# EAGLE design EL-100-020-020-PT1000 (EAGLE 6.6.0)

## Sheet 1 of 2
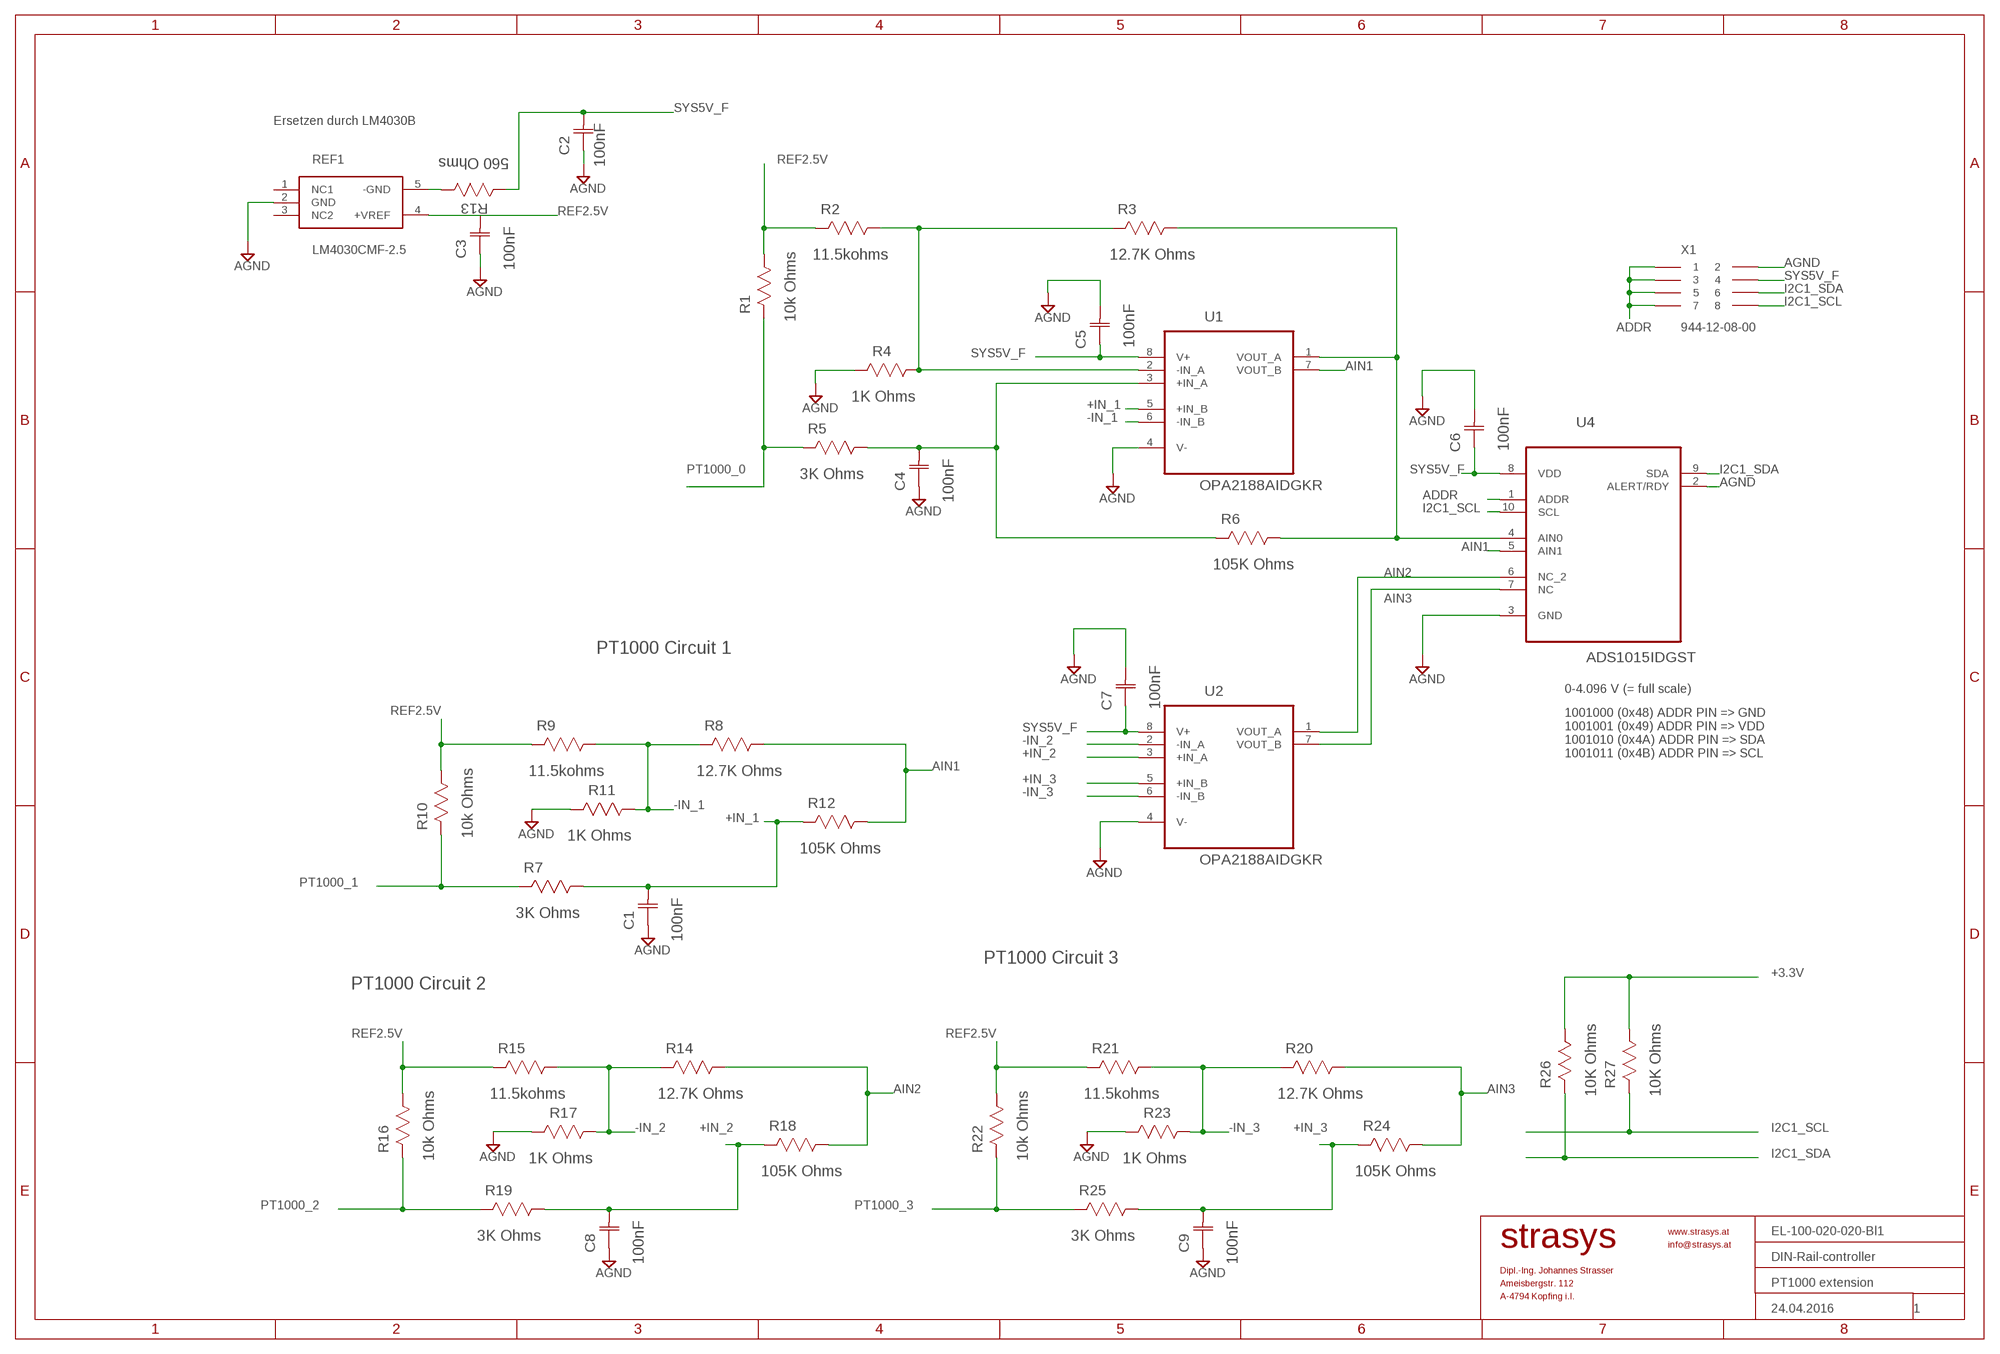
[diagram p0: schematic, sheet 1]
FRAME1 (A3L-LOC): DATE_DRAWING: 24.04.2016; DRAWING_NAME1: DIN-Rail-controller; DRAWING_NAME2: PT1000 extension; DRAWING_NO: EL-100-020-020-Bl1; PAGE: 1

### Parts
C1  100nF  C0805C104K5RACTU  [CAPC2013X110N]
C2  100nF  C0805C104K5RACTU  [CAPC2013X110N]
C3  100nF  C0805C104K5RACTU  [CAPC2013X110N]
C4  100nF  C0805C104K5RACTU  [CAPC2013X110N]
C5  100nF  C0805C104K5RACTU  [CAPC2013X110N]
C6  100nF  C0805C104K5RACTU  [CAPC2013X110N]
C7  100nF  C0805C104K5RACTU  [CAPC2013X110N]
C8  100nF  C0805C104K5RACTU  [CAPC2013X110N]
C9  100nF  C0805C104K5RACTU  [CAPC2013X110N]
R1  10k Ohms  CRCW080524K9FKEA  [RESC2013X65N]
R2  11.5kohms  ERJ6ENF3242V  [RESC2013X65N]
R3  12.7K Ohms  CRCW080530K0FKEA  [RESC2013X65N]
R4  1K Ohms  CRCW08051K00FKEA  [RESC2013X65N]
R5  3K Ohms  CRCW080530K0FKEA  [RESC2013X65N]
R6  105K Ohms  CRCW0805105KFKEA  [RESC2013X65N]
R7  3K Ohms  CRCW080530K0FKEA  [RESC2013X65N]
R8  12.7K Ohms  CRCW080530K0FKEA  [RESC2013X65N]
R9  11.5kohms  ERJ6ENF3242V  [RESC2013X65N]
R10  10k Ohms  CRCW080524K9FKEA  [RESC2013X65N]
R11  1K Ohms  CRCW08051K00FKEA  [RESC2013X65N]
R12  105K Ohms  CRCW0805105KFKEA  [RESC2013X65N]
R13  560 Ohms  CRCW080510K0JNEA  [RESC2013X65N]
R14  12.7K Ohms  CRCW080530K0FKEA  [RESC2013X65N]
R15  11.5kohms  ERJ6ENF3242V  [RESC2013X65N]
R16  10k Ohms  CRCW080524K9FKEA  [RESC2013X65N]
R17  1K Ohms  CRCW08051K00FKEA  [RESC2013X65N]
R18  105K Ohms  CRCW0805105KFKEA  [RESC2013X65N]
R19  3K Ohms  CRCW080530K0FKEA  [RESC2013X65N]
R20  12.7K Ohms  CRCW080530K0FKEA  [RESC2013X65N]
R21  11.5kohms  ERJ6ENF3242V  [RESC2013X65N]
R22  10k Ohms  CRCW080524K9FKEA  [RESC2013X65N]
R23  1K Ohms  CRCW08051K00FKEA  [RESC2013X65N]
R24  105K Ohms  CRCW0805105KFKEA  [RESC2013X65N]
R25  3K Ohms  CRCW080530K0FKEA  [RESC2013X65N]
R26  10K Ohms  CRCW080510K0JNEA  [RESC2013X65N]
R27  10K Ohms  CRCW080510K0JNEA  [RESC2013X65N]
REF1  LM4030CMF-2.5  [R-PDSO-G5]
U1  OPA2188AIDGKR  [SOP65P490X110-8N]
U2  OPA2188AIDGKR  [SOP65P490X110-8N]
U4  ADS1015IDGST  [SOP50P490X110-10N]
X1  944-12-08-00  [2,54_2X8]

### Nets
+3.3V: R26.1 R27.1 ; also sheet 2
+IN_0: C4.2(C2) R5.1 R6.2 U1.3(+IN_A)
+IN_1: C1.2(C2) R7.1 R12.2 U1.5(+IN_B)
+IN_2: C8.2(C2) R18.2 R19.1 U2.3(+IN_A)
+IN_3: C9.2(C2) R24.2 R25.1 U2.5(+IN_B)
-IN_0: R2.1 R3.2 R4.1 U1.2(-IN_A)
-IN_1: R8.2 R9.1 R11.1 U1.6(-IN_B)
-IN_2: R14.2 R15.1 R17.1 U2.2(-IN_A)
-IN_3: R20.2 R21.1 R23.1 U2.6(-IN_B)
ADDR: U4.1(ADDR) X1.P1 X1.P3 X1.P5 X1.P7
AGND: C1.1(C1) C2.1(C1) C3.1(C1) C4.1(C1) C5.2(C2) C6.2(C2) C7.2(C2) C8.1(C1) C9.1(C1) R4.2 R11.2 R17.2 R23.2 REF1.2(GND) U1.4(V-) U2.4(V-) U4.2(ALERT/RDY) U4.3(GND) X1.P2 ; also sheet 2
AIN0: R3.1 R6.1 U1.1(VOUT_A) U4.4(AIN0)
AIN1: R8.1 R12.1 U1.7(VOUT_B) U4.5(AIN1)
AIN2: R14.1 R18.1 U2.1(VOUT_A) U4.6(NC_2)
AIN3: R20.1 R24.1 U2.7(VOUT_B) U4.7(NC)
I2C1_SCL: R27.2 U4.10(SCL) X1.P8 ; also sheet 2
I2C1_SDA: R26.2 U4.9(SDA) X1.P6 ; also sheet 2
N$1: R13.1 REF1.5(-GND)
PT1000_0: R1.2 R5.2 ; also sheet 2
PT1000_1: R7.2 R10.2 ; also sheet 2
PT1000_2: R16.2 R19.2 ; also sheet 2
PT1000_3: R22.2 R25.2 ; also sheet 2
REF2.5V: C3.2(C2) R1.1 R2.2 R9.2 R10.1 R15.2 R16.1 R21.2 R22.1 REF1.4(+VREF)
SYS5V_F: C2.2(C2) C5.1(C1) C6.1(C1) C7.1(C1) R13.2 U1.8(V+) U2.8(V+) U4.8(VDD) X1.P4 ; also sheet 2
Unconnected: REF1.1(NC1) REF1.3(NC2)

### Notes on the sheet
- Ersetzen durch LM4030B
- PT1000 Circuit 1
- 0-4.096 V (= full scale)
- 1001000 (0x48) ADDR PIN => GND
  1001001 (0x49) ADDR PIN => VDD
  1001010 (0x4A) ADDR PIN => SDA
  1001011 (0x4B) ADDR PIN => SCL
- PT1000 Circuit 3
- PT1000 Circuit 2

## Sheet 2 of 2
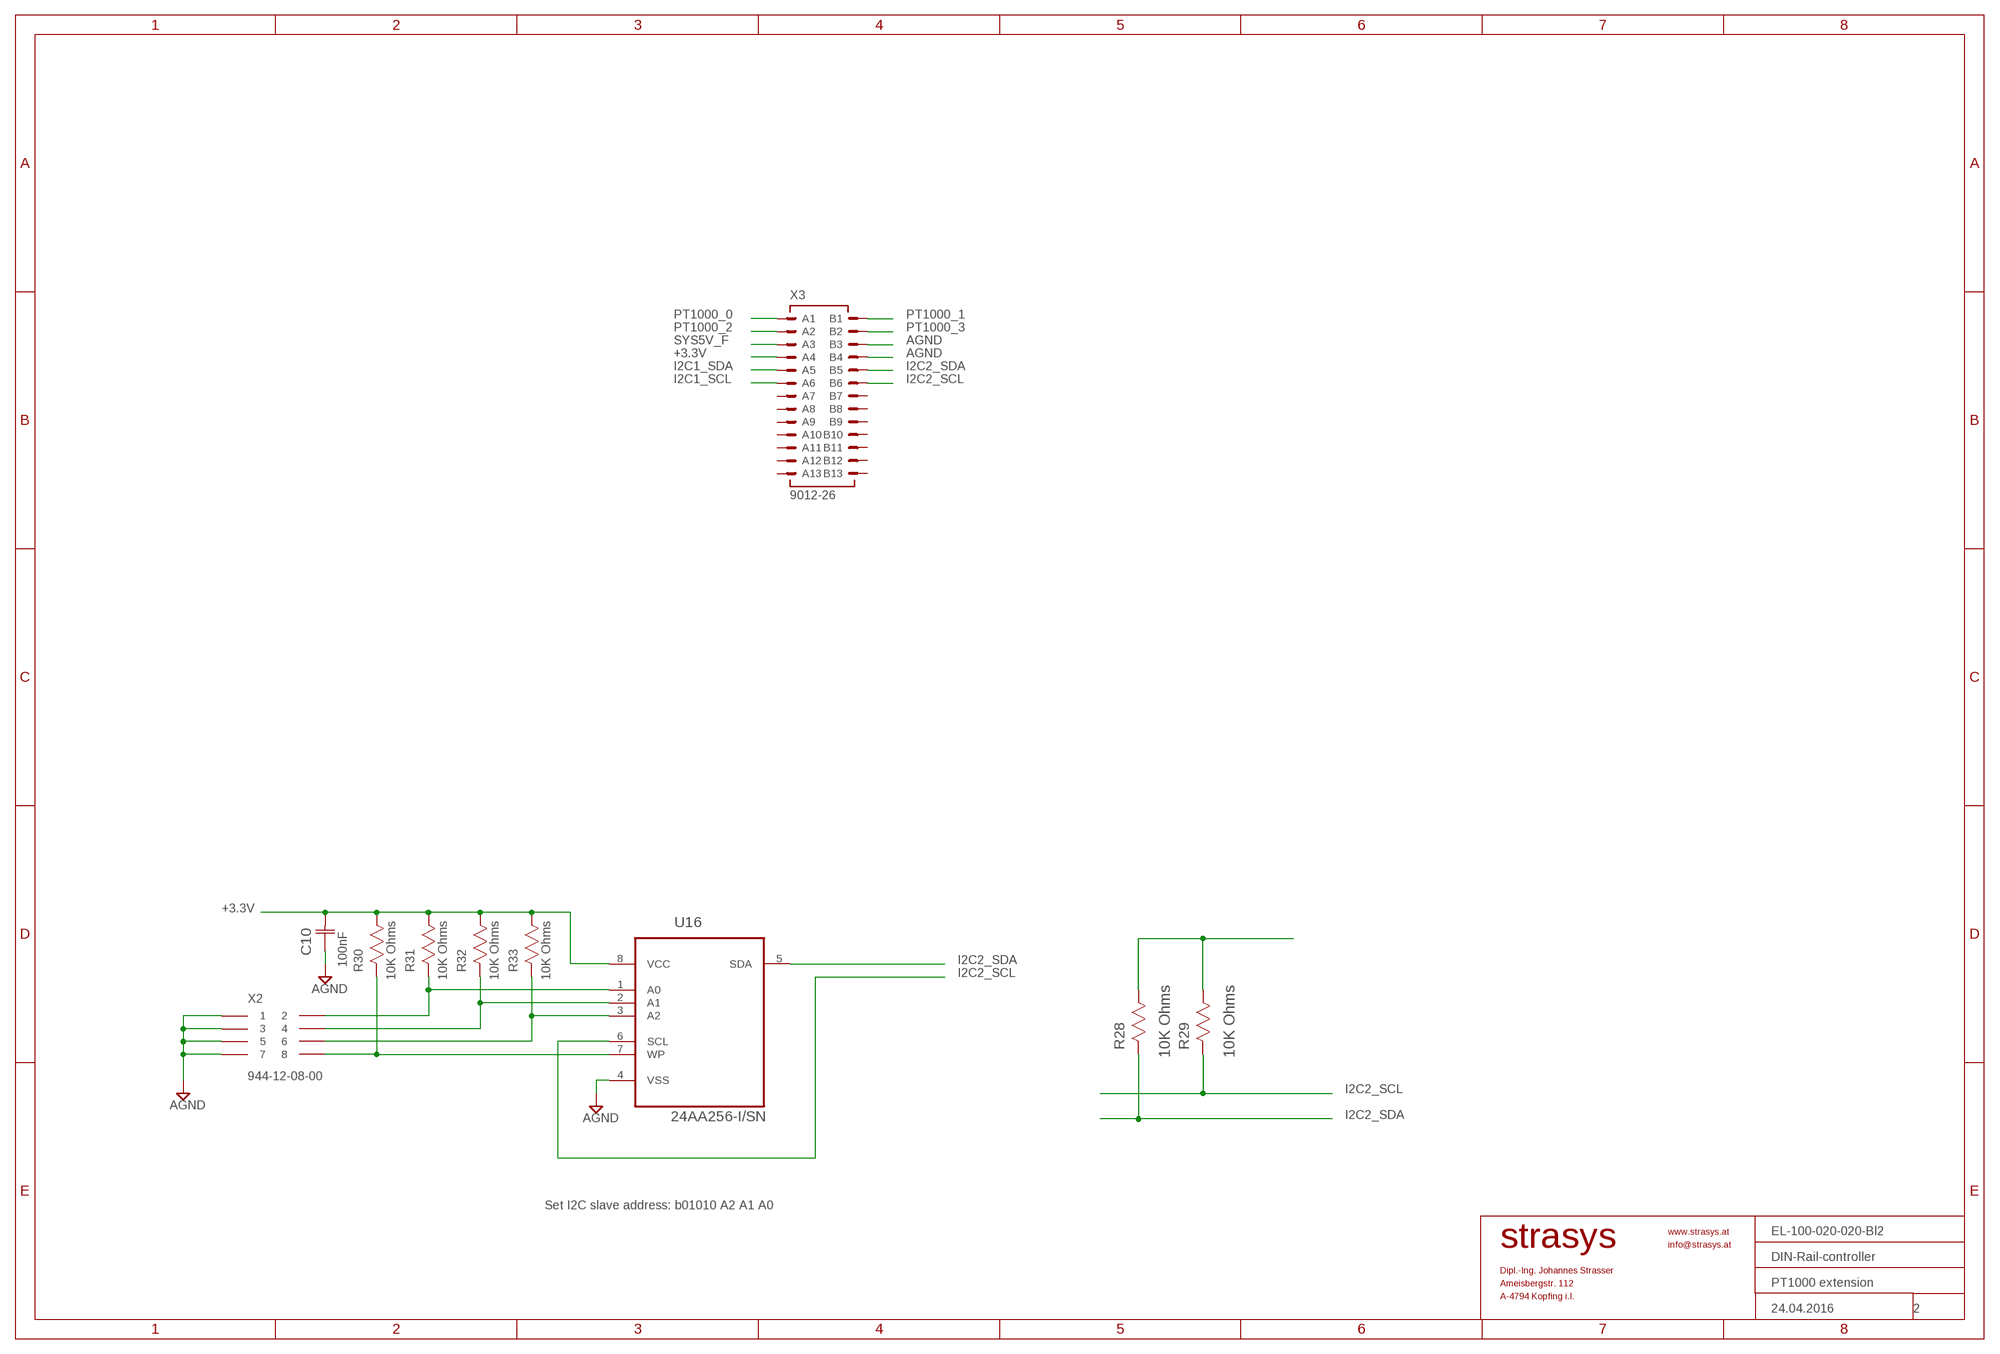
[diagram p1: schematic, sheet 2]
FRAME2 (A3L-LOC): DATE_DRAWING: 24.04.2016; DRAWING_NAME1: DIN-Rail-controller; DRAWING_NAME2: PT1000 extension; DRAWING_NO: EL-100-020-020-Bl2; PAGE: 2

### Parts
C10  100nF  C0805C104K5RACTU  [CAPC2013X110N]
R28  10K Ohms  CRCW080510K0JNEA  [RESC2013X65N]
R29  10K Ohms  CRCW080510K0JNEA  [RESC2013X65N]
R30  10K Ohms  CRCW080510K0JNEA  [RESC2013X65N]
R31  10K Ohms  CRCW080510K0JNEA  [RESC2013X65N]
R32  10K Ohms  CRCW080510K0JNEA  [RESC2013X65N]
R33  10K Ohms  CRCW080510K0JNEA  [RESC2013X65N]
U16  24AA256-I/SN  [SOIC127P600X175-8N]
X2  944-12-08-00  [2,54_2X8]
X3  9012-26  [9012-26]

### Nets
24AA-A0: R31.2 U16.1(A0) X2.P2
24AA_A1: R32.2 U16.2(A1) X2.P4
24AA_A2: R33.2 U16.3(A2) X2.P6
24AA_WP: R30.2 U16.7(WP) X2.P8
+3.3V: C10.2(C2) R28.1 R29.1 R30.1 R31.1 R32.1 R33.1 U16.8(VCC) X3.A4 ; also sheet 1
AGND: C10.1(C1) U16.4(VSS) X2.P1 X2.P3 X2.P5 X2.P7 X3.B3 X3.B4 ; also sheet 1
I2C1_SCL: X3.A6 ; also sheet 1
I2C1_SDA: X3.A5 ; also sheet 1
I2C2_SCL: R29.2 U16.6(SCL) X3.B6
I2C2_SDA: R28.2 U16.5(SDA) X3.B5
PT1000_0: X3.A1 ; also sheet 1
PT1000_1: X3.B1 ; also sheet 1
PT1000_2: X3.A2 ; also sheet 1
PT1000_3: X3.B2 ; also sheet 1
SYS5V_F: X3.A3 ; also sheet 1
Unconnected: X3.A7 X3.A8 X3.A9 X3.A10 X3.A11 X3.A12 X3.A13 X3.B7 X3.B8 X3.B9 X3.B10 X3.B11 X3.B12 X3.B13

### Notes on the sheet
- Set I2C slave address: b01010 A2 A1 A0

## Library data of the parts
C1-C10 = Kemet_By_element14_1:C0805C104K5RACTU: CAPACITOR, 0805; MF: KEMET; MPN: C0805C104K5RACTU; OC_FARNELL: 1414664; OC_NEWARK: 65H7431; SUPPLIER: Kemet; TOLERANCE: ±10%; VOLTAGERATING: 50V
R1 R10 R16 R22 = Vishay_By_element14_Batch_1:CRCW080524K9FKEA: RESISTOR, 0805; MPN: ERA6AEB103V; OC_FARNELL: 1577673; SUPPLIER: PANASONIC; TOLERANCE: ±0.1%; VALUE: 24.9K Ohms; WATTAGE: 0.125 W
R2 R9 R15 R21 = Vishay_By_element14_Batch_1:ERJ6ENF3242V: RESISTOR, 0805; MPN: MCTC0525B1152T5E; OC_FARNELL: 1575906; SUPPLIER: MULTICOMP; TOLERANCE: +/- 0.1%; VALUE: 32.4kohms; WATTAGE: 0.125 W
R3 R8 R14 R20 = Vishay_By_element14_Batch_1:CRCW080530K0FKEA: RESISTOR, 0805; MPN: MCTC0525B1272T5E; OC_FARNELL: 1575914; SUPPLIER: MULTICOMP; TOLERANCE: ±0.1%; VALUE: 30K Ohms; WATTAGE: 0.125 W
R4 R11 R17 R23 = Vishay_By_element14_Batch_1:CRCW08051K00FKEA: RESISTOR, 0805; MPN: ERA6AEB102V; OC_FARNELL: 1577659; SUPPLIER: PANASONIC; TOLERANCE: ±0.1%; WATTAGE: 0.125 W
R5 R7 R19 R25 = Vishay_By_element14_Batch_1:CRCW080530K0FKEA: RESISTOR, 0805; MPN: ERA6AEB302V; OC_FARNELL: 1670234; SUPPLIER: Panasonic; TOLERANCE: ±0.1%; VALUE: 30K Ohms; WATTAGE: 0.125 W
R6 R12 R18 R24 = Vishay_By_element14_Batch_1:CRCW0805105KFKEA: RESISTOR, 0805; MPN: MCTC0525B1053T5E; OC_FARNELL: 1576016; SUPPLIER: MULTICOMP; TOLERANCE: ±0.1%; WATTAGE: 0.125 W
R13 = Vishay_By_element14_Batch_1:CRCW080510K0JNEA: RESISTOR, 0805; MF: MULTICOMP; MPN: MCMR08X561 JTL; OC_FARNELL: 2073807; SUPPLIER: MULTICOMP; TOLERANCE: ±5%; VALUE: 10K Ohms; WATTAGE: 0.125 W
R26-R33 = Vishay_By_element14_Batch_1:CRCW080510K0JNEA: RESISTOR, 0805; MF: VISHAY DRALORIC; MPN: CRCW080510K0JNEA; OC_FARNELL: 1469857; OC_NEWARK: 52K9797; SUPPLIER: Vishay; TOLERANCE: ±5%; WATTAGE: 0.125 W
REF1 = strasys_standard:LM4030: LM4030 Shunt high precission voltage ref. LM4030AMF-2.5 => precission +/- 0.05% LM4030BMF-2.5 => precission +/- 0.1% LM4030CMF-2.5 => precission +/- 0.15%; MPN: LM4030CMF-2.5/NOPB; OC_FARNELL: 2492620; SUPPLIER: TEXAS INSTRUMENTS
U1 U2 = strasys_standard:OPA2188AIDGKR: OP AMP, GP, RR, 2MHZ, 36-V, Zero-Drift,8MSOP; MF: TEXAS INSTRUMENTS; MPN: OPA2188AIDGKR; OC_FARNELL: 2057091; OC_NEWARK: 61T5955; PACKAGE: 8MSOP; SUPPLIER: TEXAS INSTRUMENTS
U4 = ADS1015:ADS1015IDGST: Ultra-Small, Low-Power, 12-Bit Analog-to-Digital Converter with Internal Reference; MF: TEXAS INSTRUMENTS; MPN: ADS1015IDGST; OC_FARNELL: 1778211; OC_NEWARK: 35R0211; PACKAGE: MSOP-10; SUPPLIER: Texas Instruments
U16 = Microchip_By_element14_Batch_1:24AA256-I/SN: EEPROM; MF: MICROCHIP; MPN: 24AA256-I/SN; OC_FARNELL: 1331295; OC_NEWARK: 92C6874; PACKAGE: SOIC-8; SUPPLIER: MICROCHIP
X1 X2 = strasys_standard:944-12-08-00: Stiftleiste RM 2,54mm gerade 2 x 4
X3 = con-WuP:9012-26: SMT-Buchsenleiste RM 1,27mm, liegend; MPN: 9012-26; SUPPLIER: W+P

## Board
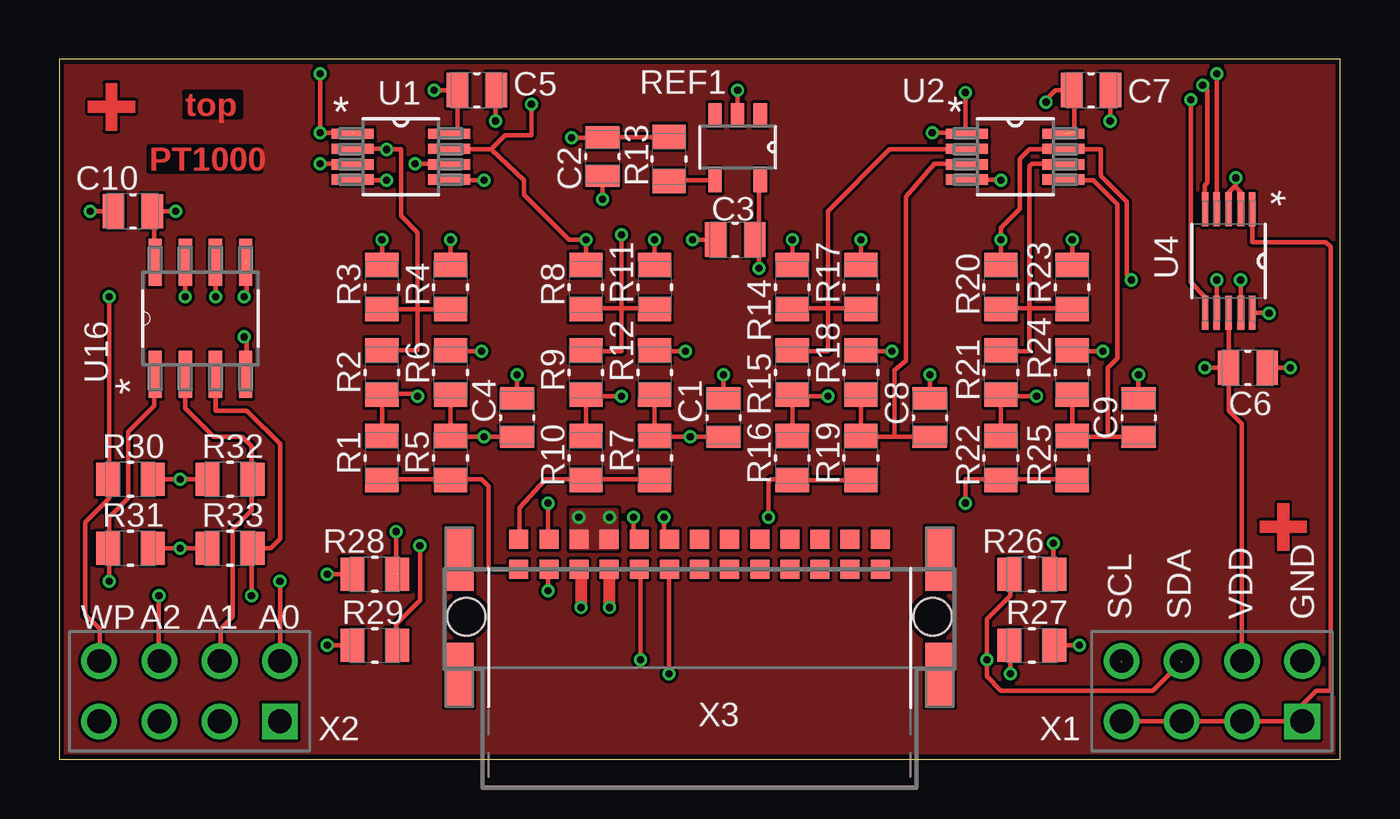
[diagram p2: board, top side]
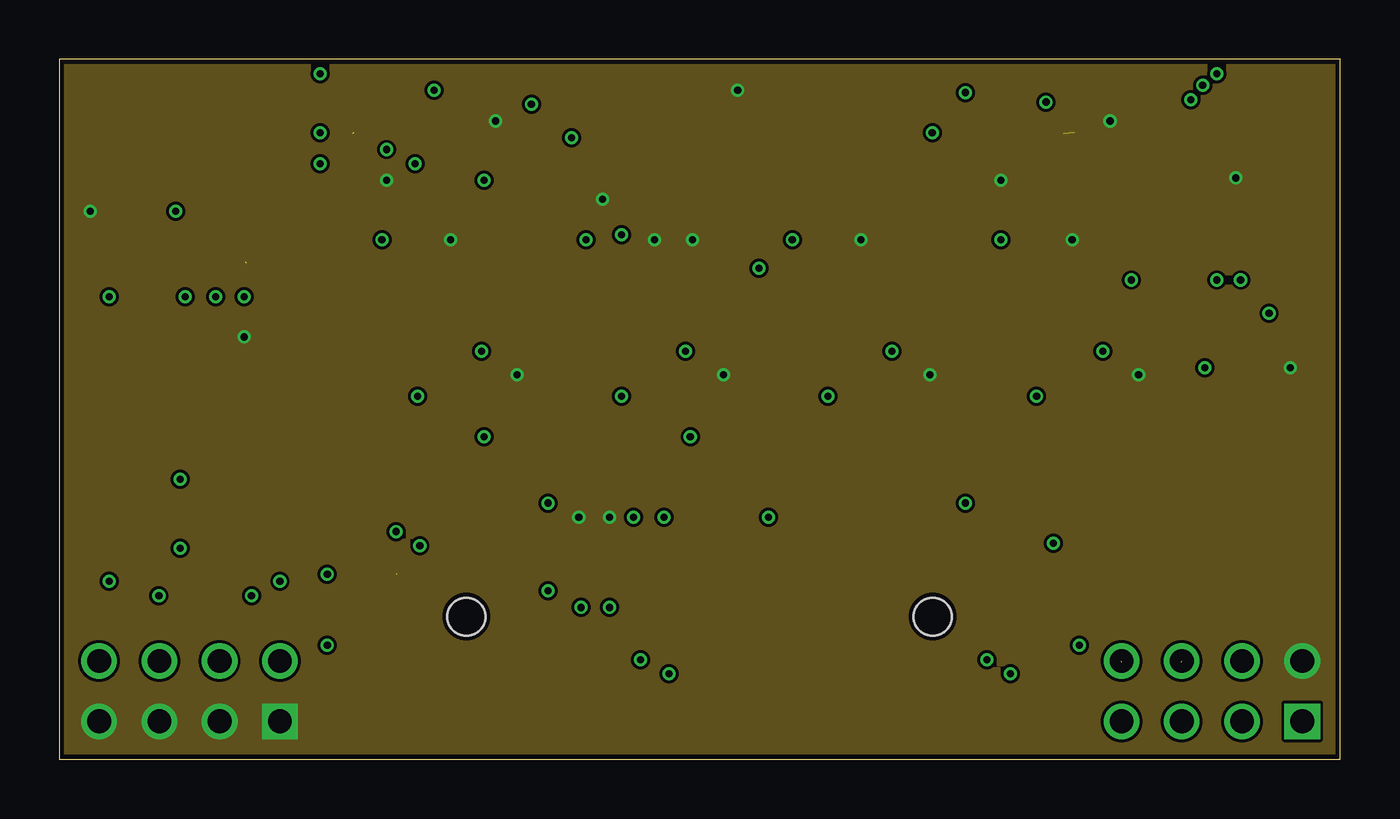
[diagram p3: board, inner layer AGND]
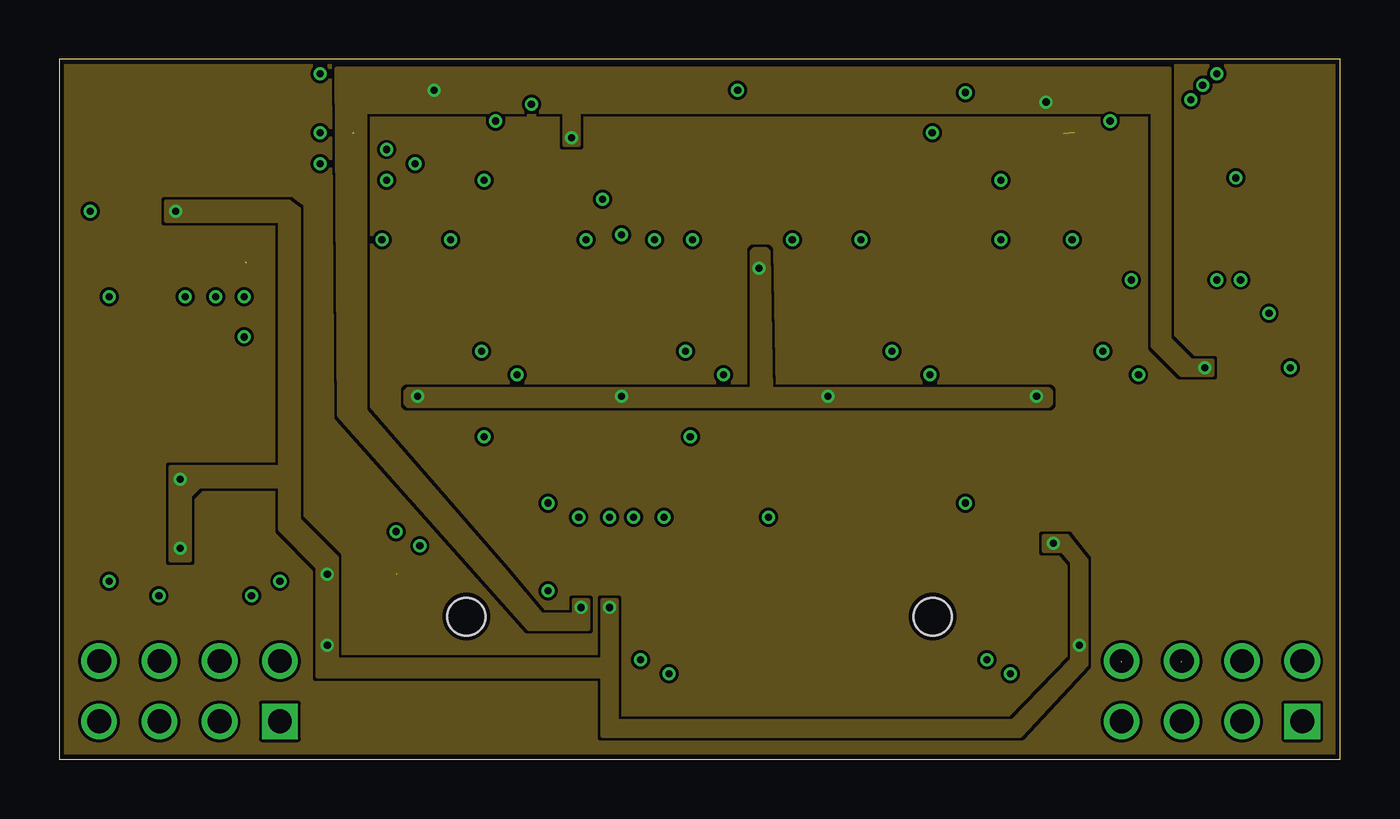
[diagram p4: board, inner layer PWR]
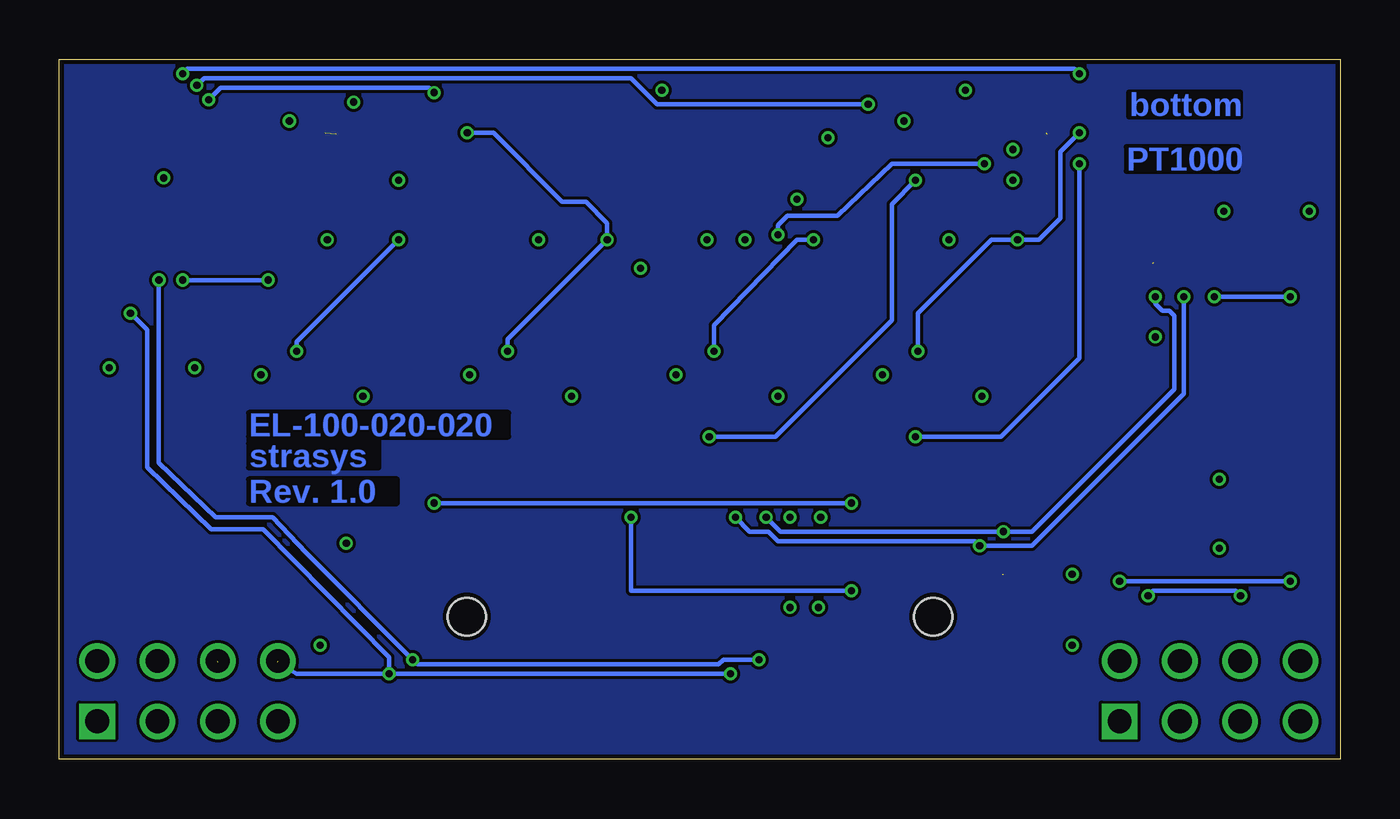
[diagram p5: board, bottom side, seen from below]

Size 54 x 29.5 mm. Coordinates in mm from the lower left corner, seen from the top.
Outline: 0,0 54,0 54,29.5 0,29.5 0,0
Copper layers (1+2*15+16): Top 0.018mm / dielectric 0.36mm / AGND 0.035mm / dielectric 0.71mm / PWR 0.035mm / dielectric 0.2mm / Bottom 0.018mm
Design rules "Multi-CB_4L_125um-Tracks_OL35um-IL35um *": minimum track width 0.125mm, minimum drill 0.2mm, track to track 0.125mm, track to pad 0.125mm, pad to pad 0.125mm, via to via 0.125mm, smd to smd 0mil, copper to edge 0.2mm, drill to drill 0.2mm, minimum pad ring 0.125mm, minimum via ring 0.125mm, stop-mask expansion 2mil, vias tented up to drill 0.45mm, thermal gap 0.2mm

### Footprints (pad centres in the part's own frame; a part is rotated, then mirrored left to right if it is on the bottom)
CAPC2013X110N = smd 0.914 x 1.448: 1 -0.813,0; 2 0.813,0
RESC2013X65N = smd 1.016 x 1.397: 1 -0.94,0; 2 0.94,0
R-PDSO-G5 = smd 0.55 x 1: 1 -0.95,-1.35; 2 0,-1.35; 3 0.95,-1.35; 4 -0.95,1.4; 5 0.95,1.4
SOP65P490X110-8N = smd 1.778 x 0.432: 1 -2.032,0.965; 2 -2.032,0.33; 3 -2.032,-0.33; 4 -2.032,-0.965; 5 2.032,-0.965; 6 2.032,-0.33; 7 2.032,0.33; 8 2.032,0.965
SOP50P490X110-10N = smd 1.422 x 0.279: 1 -2.184,0.991; 2 -2.184,0.508; 3 -2.184,0; 4 -2.184,-0.508; 5 -2.184,-0.991; 6 2.184,-0.991; 7 2.184,-0.508; 8 2.184,0; 9 2.184,0.508; 10 2.184,0.991
SOIC127P600X175-8N = smd 1.981 x 0.559: 1 -2.362,1.905; 2 -2.362,0.635; 3 -2.362,-0.635; 4 -2.362,-1.905; 5 2.362,-1.905; 6 2.362,-0.635; 7 2.362,0.635; 8 2.362,1.905
2,54_2X8 = drill 1 square: P1 0,0 | drill 1: P2 0,-2.54; P3 2.54,0; P4 2.54,-2.54; P5 5.08,0; P6 5.08,-2.54; P7 7.62,0; P8 7.62,-2.54
9012-26 = smd 0.8 x 0.8: A1 -7.62,2; A2 -6.35,2; A3 -5.08,2; A4 -3.81,2; A5 -2.54,2; A6 -1.27,2; A7 0,2; A8 1.27,2; A9 2.54,2; A10 3.81,2; A11 5.08,2; A12 6.35,2; A13 7.62,2; B1 -7.62,3.27; B2 -6.35,3.27; B3 -5.08,3.27; B4 -3.81,3.27; B5 -2.54,3.27; B6 -1.27,3.27; B7 0,3.27; B8 1.27,3.27; B9 2.54,3.27; B10 3.81,3.27; B11 5.08,3.27; B12 6.35,3.27; B13 7.62,3.27 | smd 1.2 x 2.7: M1 -10.13,2.45; M2 -10.13,-2.45; M3 10.13,2.45; M4 10.13,-2.45 | hole 1.6: -9.83,0; 9.83,0

### Placement (x,y rotation side)
C1  28,14.4 270 top
C2  22.9,25.4 90 top
C3  28.5,21.9 0 top
C4  19.3,14.4 270 top
C5  17.6,28.2 0 top
C6  50.1,16.5 0 top
C7  43.5,28.2 0 top
C8  36.7,14.4 270 top
C9  45.5,14.4 270 top
C10  3.1,23.1 0 top
R1  13.6,12.7 270 top
R2  13.6,16.3 270 top
R3  13.6,19.9 270 top
R4  16.5,19.9 90 top
R5  16.5,12.7 270 top
R6  16.5,16.3 270 top
R7  25.1,12.7 270 top
R8  22.2,19.9 270 top
R9  22.2,16.3 270 top
R10  22.2,12.7 270 top
R11  25.1,19.9 90 top
R12  25.1,16.3 270 top
R13  25.7,25.3 90 top
R14  30.9,19.9 270 top
R15  30.9,16.3 270 top
R16  30.9,12.7 270 top
R17  33.8,19.9 90 top
R18  33.8,16.3 270 top
R19  33.8,12.7 270 top
R20  39.7,19.9 270 top
R21  39.7,16.3 270 top
R22  39.7,12.7 270 top
R23  42.7,19.9 90 top
R24  42.7,16.3 270 top
R25  42.7,12.7 270 top
R26  41,7.8 180 top
R27  41,4.8 180 top
R28  13.3,7.8 0 top
R29  13.3,4.8 0 top
R30  3,11.8 180 top
R31  3,8.9 180 top
R32  7.2,11.8 0 top
R33  7.2,8.9 0 top
REF1  28.6,25.8 180 top
U1  14.4,25.4 0 top
U2  40.3,25.4 0 top
U4  49.3,21 270 top
U16  5.95,18.58 90 top
U$1  [PASSER_SMD4]  2.2,27.5 0 top
U$2  [PASSER_SMD4]  51.6,9.8 0 top
X1  52.4,1.6 180 top
X2  9.3,1.6 180 top
X3  26.99,6.01 0 top

### Tracks (layer width: path | path; a pad name or v marks a point on that pad's centre or on a via)
24AA-A0  (via drill 0.3)
  Top 0.2: v2.1,7.5 2.1,8.9 | X2.P2 v9.3,7.5 | 2.1,8.9 2.1,10.2 2.9,11 2.9,13.8 4,14.9 4,16.2 U16.1 | 2.1,8.9 R31.2
  Bottom 0.2: v9.3,7.5 v2.1,7.5
24AA_A1
  Top 0.2: 8.1,11.8 8.1,10.5 7.3,9.7 7.3,6 6.8,5.5 6.8,4.2 X2.P4 | U16.2 5.3,15.6 5.3,14.8 6.5,13.6 7.7,13.6 8.1,13.2 8.1,11.8 | 8.1,11.8 R32.2
24AA_A2  (via drill 0.3)
  Top 0.2: v8.1,6.9 8.1,8.9 R33.2 8.9,8.9 9.3,9.3 9.3,13.3 7.9,14.7 6.6,14.7 6.6,16.2 U16.3 | v4.2,6.9 4.2,4.2 X2.P6
  Bottom 0.2: v8.1,6.9 7.9,7.1 4.4,7.1 v4.2,6.9
24AA_WP  (via drill 0.3)
  Top 0.2: 2.1,11.8 2.1,11 1.1,10 1.1,6.1 1.7,5.5 1.7,4.2 X2.P8 | v2.1,19.5 2.1,11.8 | v5.3,19.5 5.3,20.9 U16.7 | 2.1,11.8 R30.2
  Bottom 0.2: v5.3,19.5 v2.1,19.5
+3.3V  (via drill 0.3)
  Top 0.2: 4,23.1 4,21 U16.8 | R30.1 v5.1,11.8 R32.1 | R31.1 v5.1,8.9 R33.1 | v11.3,7.8 R28.1 | v11.3,4.8 R29.1 | 4,23.1 v4.9,23.1 | 4,23.1 C10.2 | v43,4.8 R27.1 | v41.9,9.1 41.9,7.8 R26.1 | 23.2,8 X3.A4
  Top 0.5: v23.2,6.4 23.2,8
  pour PWR (no thermals): 4.5,23.5 9.7,23.5 10.1,23.2 10.1,10.1 11.7,8.5 11.7,3.5 10.9,3.5 10.9,8.1 9.3,9.7 9.3,22.7 4.5,22.7
  pour PWR (no thermals): 4.7,8.4 5.5,8.4 5.5,11.1 5.9,11.5 9.7,11.5 9.7,12.3 4.7,12.3
  pour PWR (no thermals): 10.9,3.5 23.5,3.5 23.5,6.7 22.9,6.7 22.9,4.2 10.9,4.2
  pour PWR (no thermals): 22.9,4.2 22.9,1 40.5,1 43.3,4 43.3,8.4 42.5,9.4 41.5,9.4 41.5,8.8 42.3,8.8 42.7,8.3 42.7,4.2 40.2,1.6 23.5,1.6 23.5,4.2
+IN_0  (via drill 0.3)
  Top 0.2: C4.2 v17.9,13.6 16.5,13.6 R5.1 R6.2 | v11,25.1 12.3,25.1 U1.3
  Bottom 0.2: v11,25.1 11,16.9 14.3,13.6 v17.9,13.6
+IN_1  (via drill 0.3)
  Top 0.2: R12.2 R7.1 25.1,13.6 v26.6,13.6 C1.2 | v17.9,24.4 16.5,24.4 U1.5
  Bottom 0.2: v26.6,13.6 23.8,13.6 18.9,18.5 18.9,23.4 v17.9,24.4
+IN_2
  Top 0.2: 35.2,13.6 33.8,13.6 R19.1 R18.2 | 35.2,13.6 C8.2 | U2.3 38.2,25.1 36.9,25.1 35.7,23.7 35.7,16.8 35.2,16.4 35.2,13.6
+IN_3
  Top 0.2: 44.2,13.6 C9.2 | 44.2,13.6 42.7,13.6 R25.1 R24.2 | 44.2,13.6 44.2,16.5 44.6,16.9 44.6,23.4 43.6,24.4 42.4,24.4 U2.5
-IN_0  (via drill 0.3)
  Top 0.2: R3.2 15.1,18.96 | R4.1 15.1,18.96 | R2.1 15.1,17.24 15.1,18.96 | U1.2 13.77,25.73 v13.8,25.7 14.4,25.7 14.4,22.9 15.1,22.2 15.1,18.96
-IN_1  (via drill 0.3)
  Top 0.2: R9.1 22.2,17.2 23.7,17.2 v23.7,22.1 23.7,19 | 23.7,19 22.2,19 R8.2 | 23.7,19 25.1,19 R11.1 | v15,25.1 16.4,25.1 U1.6
  Bottom 0.2: v23.7,22.1 23.7,22.5 23.3,22.9 21.2,22.9 18.9,25.1 v15,25.1
-IN_2
  Top 0.2: 32.4,19 33.8,19 R17.1 | 32.4,19 30.9,19 R14.2 | R15.1 30.9,17.2 32.4,17.2 32.4,19 | 32.4,19 32.4,23.1 35,25.7 38.2,25.7 U2.2
-IN_3
  Top 0.2: 40.9,19 39.7,19 R20.2 | 40.9,19 42.7,19 R23.1 | R21.1 39.7,17.2 40.9,17.2 40.9,19 | U2.6 42.3,25.1 41,25.1 40.9,25 40.9,19
ADDR
  Top 0.2: U4.1 50.3,23.1 50.3,21.8 53.4,21.8 53.6,21.6 53.6,2.9 53,2.9 52.4,2.3 X1.P1 X1.P3 X1.P5 X1.P7
AGND  (via drill 0.3)
  Top 0.2: C4.1 v19.3,16.2 | R4.2 v16.5,21.9 | 12.3,24.4 v13.8,24.4 | 12.3,24.4 12.1,24.4 | 12.3,24.4 U1.4 | v18.4,26.9 C5.2 | C1.1 v28,16.2 | R11.2 v25.1,21.9 | C8.1 v36.7,16.2 | R17.2 v33.8,21.9 | REF1.2 v28.6,28.2 | C3.1 v26.7,21.9 | v22.9,23.6 C2.1 | U2.4 39.66,24.43 v39.7,24.4 | C7.2 44.31,27.61 44.3,27.6 v44.3,26.9 | C9.1 v45.5,16.2 | R23.2 v42.7,21.9 | v49.6,24.5 49.6,24.2 49.55,24.15 | 49.55,24.15 49.3,23.9 U4.3 | 49.55,24.15 49.8,23.9 49.8,23.2 U4.2 | C6.2 v51.9,16.5 | C10.1 v1.3,23.1 | v7.8,17.8 7.9,17.7 7.9,16.3 U16.4
  other vias: 21.9,10.2 23.2,10.2
  pour AGND (no thermals): 0,0 54,0 54,29.5 0,29.5
  pour Top (no thermals): 21.6,10.5 23.5,10.5 23.5,8.9 21.6,8.9
AIN0  (via drill 0.3)  (1 unrouted)
  Top 0.2: v17.8,17.2 16.5,17.2 R6.1 | R3.1 v13.6,21.9 | 12.4,26.4 v11,26.4 v11,28.9 | v48.8,28.9 48.8,23.2 U4.4
  Bottom 0.2: v17.8,17.2 17.8,18.8 14.7,21.9 v13.6,21.9 12.7,21.9 11.8,22.8 11.8,25.6 v11,26.4 | v11,28.9 11.2,29.1 48.6,29.1 v48.8,28.9
AIN1  (via drill 0.3)
  Top 0.2: v26.4,17.2 25.1,17.2 R12.1 | R8.1 v22.2,21.9 21.5,21.9 19.6,23.8 19.6,24.4 18.2,25.7 | 18.2,25.7 16.46,25.7 U1.7 | v19.9,27.6 19.9,26.3 18.8,26.3 18.2,25.7 | v48.2,28.4 48.4,28.2 48.4,24.3 48.3,24.2 48.3,23.2 U4.5
  Bottom 0.2: v26.4,17.2 26.4,18.3 22.9,21.9 v22.2,21.9 | v19.9,27.6 28.8,27.6 29.9,28.7 47.9,28.7 v48.2,28.4
AIN2  (via drill 0.3)
  Top 0.2: R14.1 v30.9,21.9 | v35.1,17.2 33.8,17.2 R18.1 | v36.8,26.4 38.2,26.4 U2.1 38.2,26.5 v38.2,28.1 | v47.7,27.8 47.7,20.1 48.3,19.5 48.3,18.9 U4.6
  Bottom 0.2: v35.1,17.2 35.1,17.7 v30.9,21.9 30.9,22.6 31.8,23.5 32.8,23.5 35.7,26.4 v36.8,26.4 | v38.2,28.1 38.4,28.3 47.2,28.3 v47.7,27.8
AIN3  (via drill 0.3)
  Top 0.2: v44,17.2 42.7,17.2 R24.1 | R20.1 v39.7,21.9 39.7,22.4 40.5,23.2 40.5,25.3 40.9,25.7 42.3,25.7 U2.7 42.4,25.7 43.9,25.7 43.9,24.6 45,23.5 45,20.4 v45.2,20.2 | v48.8,20.2 48.8,18.9 U4.7
  Bottom 0.2: v44,17.2 44,17.6 v39.7,21.9 | v48.8,20.2 v45.2,20.2
I2C1_SCL  (via drill 0.3)  (1 unrouted)
  Top 0.2: v25.7,3.6 25.7,8 X3.A6 | v40.1,3.6 40.1,4.8 R27.2 | U4.10 50.98,18.82 v51,18.8
  Bottom 0.2: v40.1,3.6 v25.7,3.6 | v40.1,3.6 40.1,4.3 45.4,9.7 47.6,9.7 50.3,12.3 50.3,18.1 v51,18.8 | v40.1,3.6 44,3.6 44.8,4.1
I2C1_SDA  (via drill 0.3)  (1 unrouted)
  Top 0.2: v24.5,4.2 24.5,8 X3.A5 | R26.2 40.1,7.8 40.1,6.9 39.1,5.9 v39.1,4.2 39.1,3.5 39.7,2.9 46.1,2.9 47.3,4.1 | 49.8,18.8 U4.9 49.8,18.9 v49.8,20.2
  Bottom 0.2: v24.5,4.2 26,4.2 26.2,4 38.9,4 v39.1,4.2 43.6,8.7 45,10.2 47.4,10.2 49.8,12.5 v49.8,20.2
I2C2_SCL  (via drill 0.3)
  Top 0.2: v15.2,9 15.2,6.7 14.2,5.7 14.2,4.8 R29.2 | v25.5,10.2 25.5,9.4 25.7,9.2 X3.B6 | v6.6,19.5 6.6,20.9 U16.6
  Bottom 0.2: v25.5,10.2 24.9,9.6 24.1,9.6 23.7,9.2 15.4,9.2 v15.2,9 13,9 6.6,15.4 v6.6,19.5
I2C2_SDA  (via drill 0.3)  (2 unrouted)
  Top 0.2: v14.2,9.6 14.2,7.8 | v24.2,10.2 24.2,9.4 24.4,9.2 X3.B5 | v7.8,19.5 7.9,19.6 7.9,20.9
  Bottom 0.2: v7.8,19.5 7.8,19.2 7.5,18.9 7.2,18.9 7,18.7 7,15.6 13,9.6 v14.2,9.6 23.6,9.6 v24.2,10.2
N$1
  Top 0.2: REF1.5 25.7,24.4 R13.1
PE
  pour Top (rank 6): 0,29.5 54,29.5 54,0 0,0
  pour Bottom (rank 6): 54,0 0,0 0,29.5 54,29.5
  pour PWR (rank 6): 0,29.5 54,29.5 54,0 0,0
PT1000_0
  Top 0.2: 16.5,11.8 13.6,11.8 R1.2 | 16.5,11.8 17.8,11.8 18.1,11.5 18.1,8 19.3,8 X3.A1 | 16.5,11.8 R5.2
PT1000_1
  Top 0.2: 19.4,9.3 19.4,10.6 20.5,11.8 22.2,11.8 | 19.4,9.3 19.6,9.3 | 19.4,9.3 X3.B1 | 22.2,11.8 25.1,11.8 R7.2 | 22.2,11.8 R10.2
PT1000_2  (via drill 0.3)
  Top 0.2: R19.2 R16.2 30.9,11.8 30,11.8 29.9,11.7 v29.9,10.2 | 20.6,7 v20.6,7.1 20.6,7.9 20.5,8 20.6,8.1 X3.A2
  Bottom 0.2: v20.6,7.1 29.9,7.1 v29.9,10.2
PT1000_3  (via drill 0.3)
  Top 0.2: 39.7,11.8 42.7,11.8 R25.2 | v38.2,10.8 38.2,11.8 39.7,11.8 | 39.7,11.8 R22.2 | v20.6,10.8 20.6,9.4 20.5,9.3 20.6,9.2 X3.B2
  Bottom 0.2: v38.2,10.8 v20.6,10.8
REF2.5V  (via drill 0.3)
  Top 0.2: R1.1 R2.2 13.6,15.4 15,15.4 v15.1,15.3 | R10.1 R9.2 22.26,15.3 v23.7,15.3 | R16.1 30.9,15.3 | 30.9,15.3 v32.4,15.3 | 30.9,15.3 R15.2 | v41.2,15.3 39.7,15.3 | R22.1 39.7,15.3 | 39.7,15.3 R21.2 | 29.6,24.4 REF1.4 29.5,24.4 29.5,22.2 C3.2 29.3,21.8 29.5,21.8 v29.5,20.7
  pour PWR (no thermals): 14.7,15.6 41.7,15.6 41.8,15.5 41.8,15.1 41.8,15 41.7,14.9 14.7,14.9 14.6,15 14.6,15.4 14.6,15.5
  pour PWR (no thermals): 29.3,21.5 29.8,21.5 29.9,21.4 30,15.5 29.2,15.5 29.2,21.4
SYS5V_F  (via drill 0.3)  (1 unrouted)
  Top 0.2: U1.8 16.5,26.4 16.8,26.4 16.8,28.1 C5.1 v15.8,28.2 | 42.8,26.4 42.8,28.2 C7.1 42,28.2 41.6,27.8 v41.6,27.7 | U4.8 C6.1 | X1.P4 49.86,14.14 49.3,14.7 49.3,16.49 C6.1 | 22,7.9 22.1,8 22,8.1 X3.A3 | v48.3,16.5 C6.1 | v21.6,26.2 22.89,26.2 C2.2 25.67,26.21 R13.2
  Top 0.5: 22,7.9 v22,6.4
  pour PWR (no thermals): 22.3,6.7 21.7,6.7 21.7,6.1 20.3,6.1 18.8,7.9 12.9,14.7 12.9,27.3 46.8,27.3 46.8,29.1 11.7,29.1 11.8,14.5 19.8,5.5 22.3,5.5
  pour PWR (no thermals): 46.8,27.6 46.8,17.7 47.7,16.8 48.6,16.8 48.6,16.2 47.3,16.2 46.1,17.4 46.1,27.6
  pour PWR (no thermals): 21.3,25.9 21.9,25.9 21.9,27.4 21.3,27.4

### Text on the board
Top: top | PT1000
Bottom: bottom | PT1000 | EL-100-020-020 | strasys | Rev. 1.0
tPlace: WP | A2 | A1 | A0 | SCL | SDA | VDD | GND